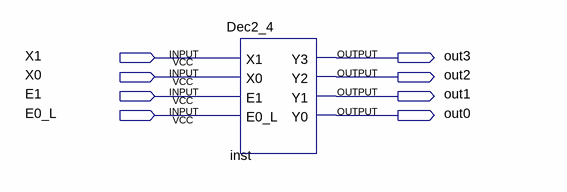
[diagram p0: schematic sheet]
// Quartus schematic DecoderDemo.bdf as structural Verilog: 1 symbols, 8 pins
module DecoderDemo (
  input  X1,
  input  X0,
  input  E1,
  input  E0_L,
  output out3,
  output out2,
  output out1,
  output out0
);

  Dec2_4 inst (.X1(X1), .X0(X0), .E1(E1), .E0_L(E0_L), .Y3(out3), .Y2(out2), .Y1(out1), .Y0(out0));
endmodule
